# Altium schematic sheet obc-v2_DEBUG.SchDoc
size 420 x 297 mm; SheetNumber: 9; SheetTotal: 21
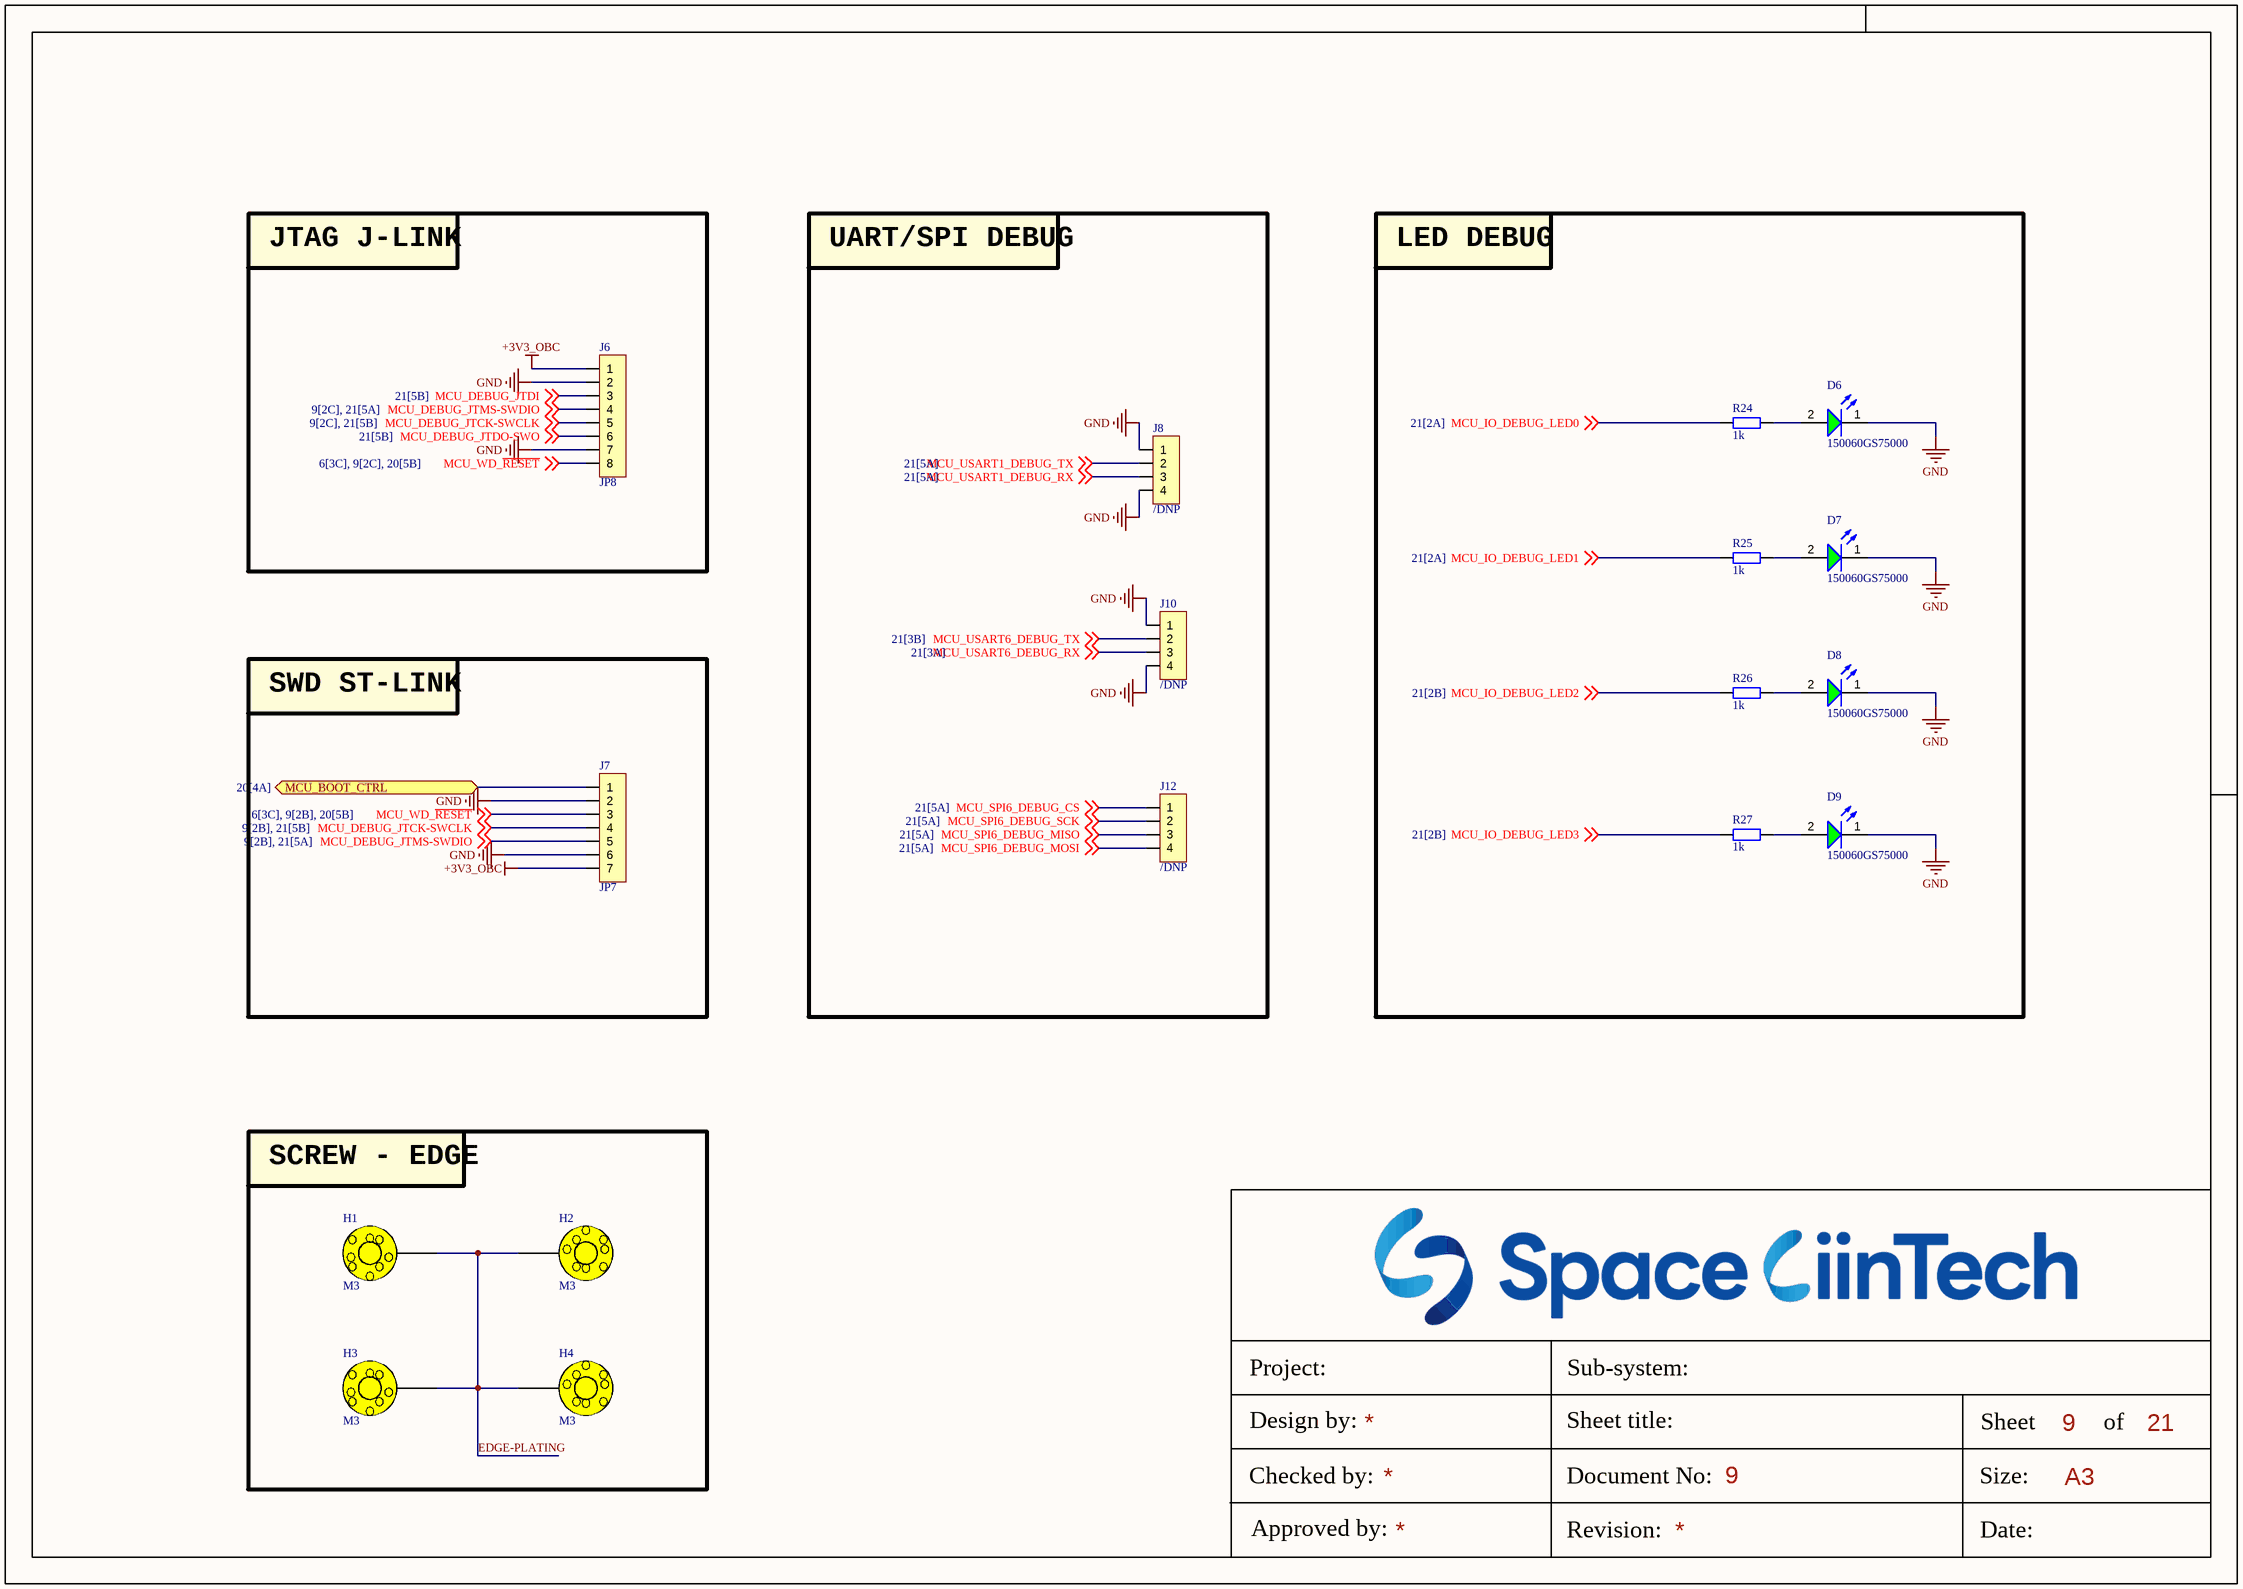
[diagram p0: obc-v2_DEBUG.SchDoc]

## Parts
D6  150060GS75000  [WL-SMCW_0603_150060xx75000]
D7  150060GS75000  [WL-SMCW_0603_150060xx75000]
D8  150060GS75000  [WL-SMCW_0603_150060xx75000]
D9  150060GS75000  [WL-SMCW_0603_150060xx75000]
H1  M3  [HEX-M3]
H2  M3  [HEX-M3]
H3  M3  [HEX-M3]
H4  M3  [HEX-M3]
J6  JP8  [JP8-C1T]
J7  JP7  [JP7-C1T]
J8  /DNP  [JP4-C1T]
J10  /DNP  [JP4-C1T]
J12  /DNP  [JP4-C1T]
R24  1k  [RES_C_1608X60]
R25  1k  [RES_C_1608X60]
R26  1k  [RES_C_1608X60]
R27  1k  [RES_C_1608X60]

## Blocks framed on the sheet
JTAG J-LINK: J6
UART/SPI DEBUG: J8 J10 J12
LED DEBUG: D6-D9 R24-R27
SWD ST-LINK: J7
SCREW - EDGE: H1-H4

## Ports
MCU_BOOT_CTRL (bidir, see 20[4A])

## Nets
+3V3_OBC: J6.1 J7.7
GND: D6.1(K) D7.1(K) D8.1(K) D9.1(K) J6.2 J6.7 J7.2 J7.6 J8.1 J8.4 J10.1 J10.4
EDGE-PLATING: H1.1 H2.1 H3.1 H4.1
MCU_BOOT_CTRL: J7.1 ; port MCU_BOOT_CTRL
MCU_DEBUG_JTCK-SWCLK: J6.5 J7.4 ; off-sheet MCU_DEBUG_JTCK-SWCLK
MCU_DEBUG_JTDI: J6.3 ; off-sheet MCU_DEBUG_JTDI
MCU_DEBUG_JTDO-SWO: J6.6 ; off-sheet MCU_DEBUG_JTDO-SWO
MCU_DEBUG_JTMS-SWDIO: J6.4 J7.5 ; off-sheet MCU_DEBUG_JTMS-SWDIO
MCU_IO_DEBUG_LED0: R24.2 ; off-sheet MCU_IO_DEBUG_LED0
MCU_IO_DEBUG_LED1: R25.2 ; off-sheet MCU_IO_DEBUG_LED1
MCU_IO_DEBUG_LED2: R26.2 ; off-sheet MCU_IO_DEBUG_LED2
MCU_IO_DEBUG_LED3: R27.2 ; off-sheet MCU_IO_DEBUG_LED3
MCU_SPI6_DEBUG_CS: J12.1 ; off-sheet MCU_SPI6_DEBUG_CS
MCU_SPI6_DEBUG_MISO: J12.3 ; off-sheet MCU_SPI6_DEBUG_MISO
MCU_SPI6_DEBUG_MOSI: J12.4 ; off-sheet MCU_SPI6_DEBUG_MOSI
MCU_SPI6_DEBUG_SCK: J12.2 ; off-sheet MCU_SPI6_DEBUG_SCK
MCU_USART1_DEBUG_RX: J8.3 ; off-sheet MCU_USART1_DEBUG_RX
MCU_USART1_DEBUG_TX: J8.2 ; off-sheet MCU_USART1_DEBUG_TX
MCU_USART6_DEBUG_RX: J10.3 ; off-sheet MCU_USART6_DEBUG_RX
MCU_USART6_DEBUG_TX: J10.2 ; off-sheet MCU_USART6_DEBUG_TX
MCU_WD_~{RESET}: J6.8 J7.3 ; off-sheet MCU_WD_~{RESET}
NetD6_2: D6.2(A) R24.1
NetD7_2: D7.2(A) R25.1
NetD8_2: D8.2(A) R26.1
NetD9_2: D9.2(A) R27.1

## Notes on the sheet
- Project:
- Sub-system:
- Design by:
- Sheet title:
- Sheet
- A3
- of
- Checked by:
- Approved by:
- Revision:
- Document No:
- Size:
- Date:

## Library data of the parts
D6-D9 = CMP-1426-00002-4: 430mcd Colorless transparence 520nm Emerald 140° LED0603 Light Emitting Diodes (LED) ROHS; Peak Wavelength: 515nm; Forward Current: 100mA; Reverse Voltage: 5V; Output Current: 10µA; Power Dissipation: 105mW; Lens Style: Clear, Rectangular; Dominant Wavelength: 525nm; Color: Green; Test Current: 20mA; Max Junction Temperature (Tj): 95°C; Forward Voltage: 3.2V; Width: 800µm; Max Operating Temperature: 85°C; Case Code (Metric): 1608; Luminous Intensity: 430mcd; Lead Free: Lead Free; Case/Package: 0603; Case Code (Imperial): 0603; Mount: Surface Mount; Max Reverse Voltage (DC): 5V; Packaging: Tape and Reel; RoHS: Compliant; Viewing Angle: 140°; REACH SVHC: Unknown; Min Operating Temperature: -40°C; Height: 700µm; Wavelength: 525nm; Length: 1.6mm
H1-H4 = HEX-M3
J8 J10 J12 = JP4: WR-PHD 2.54 mm Angled Socket Header; Manufacturer: W¨¹rth Elektronik eiSos GmbH; partNo: 613004143121; ComponentLink1 Description: Manufacturer; ComponentLink2 Description: Datasheet; NoPins: 04; Created Date: 29 March 2013; ComponentLink1URL: http://www.we-online.com; ComponentLink2URL: http://katalog.we-online.de/em/datasheet/6130xx143121.pdf; Created by: Karrer Zheng
R24-R27 = Tro 0603 1% 10k: RES; Chung_Loai: Dán; Don_Vi: Con; So_Chan: 2; Ten_Linh_Kien: Trở 0603 1% 10k; Ma_Hang: MH006333; Kieu_Chan: *